# Altium schematic sheet 01_SERIALIZER_V1-0.SchDoc: RPi GS CAM SER.
size A3; Date: 2023-05-29; Author: M. Weimann; Organization: Altium Limited; Revision: 1.0; SheetNumber: 2; SheetTotal: 5; Title_Subtitle: Serializer; Language: DE; Department: F&E; Filename: RPi-GS-CAM-SER_PCB_V1-0.PDF; Project: PI-0017; DocType: Stromlauf; ItemNo-PCB: n/a
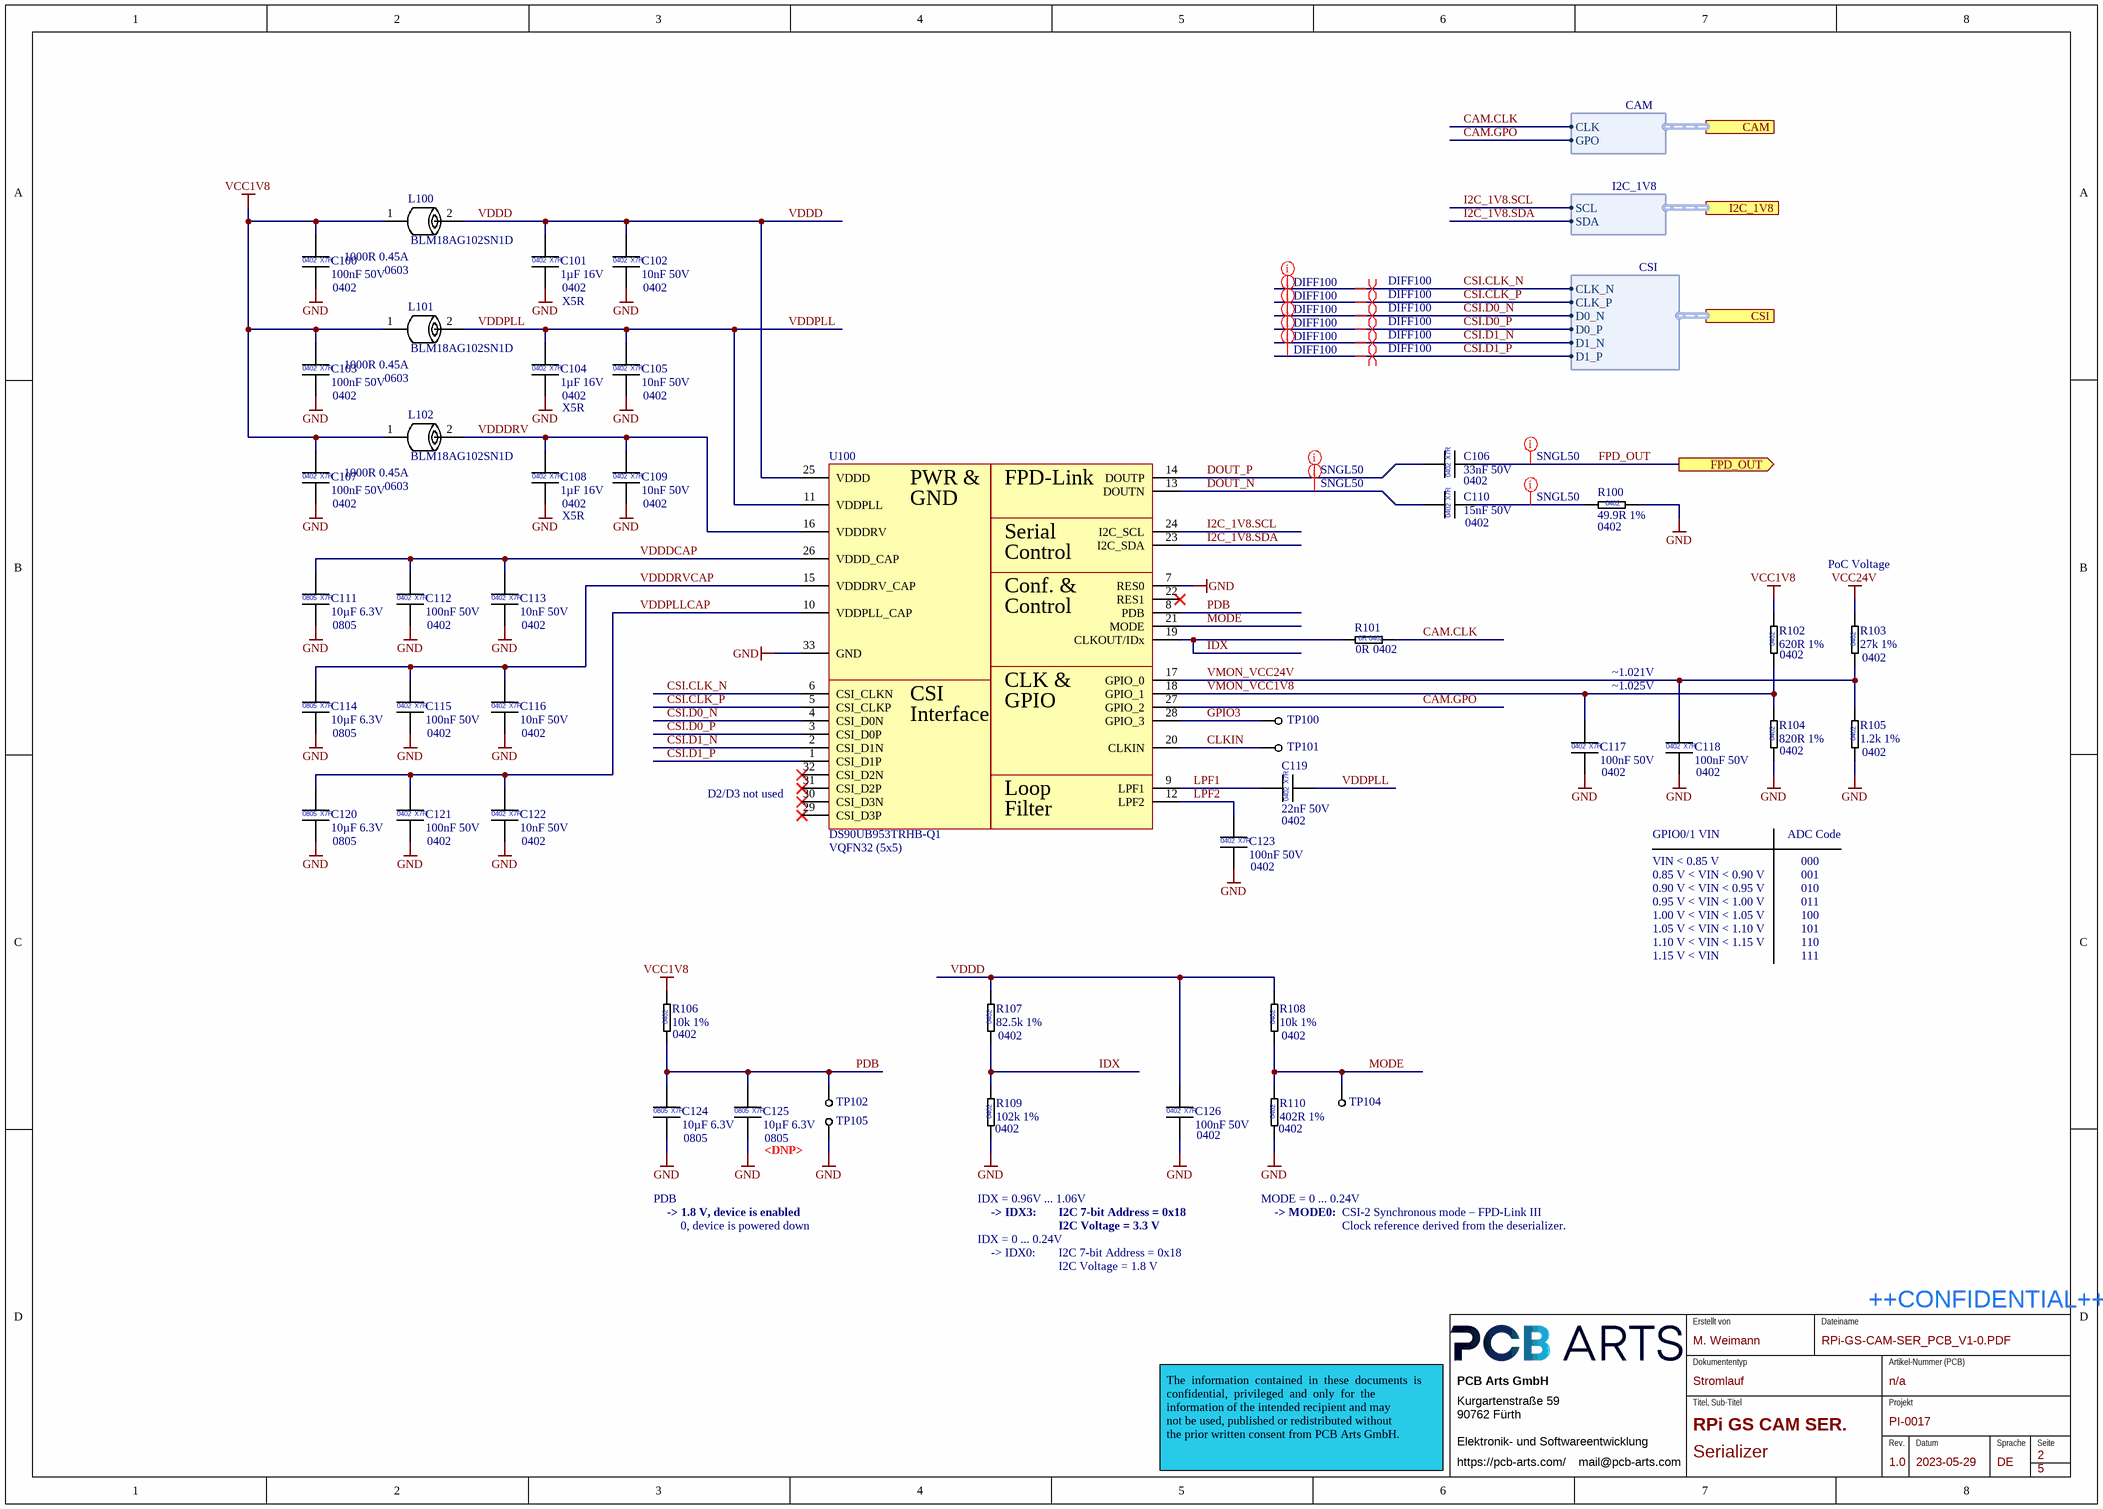
[diagram p0: 01_SERIALIZER_V1-0.SchDoc]

## Parts
C100  100nF 50V  [CAP_0402_L]
C101  1µF 16V  [CAP_0402_L]
C102  10nF 50V  [CAP_0402_L]
C103  100nF 50V  [CAP_0402_L]
C104  1µF 16V  [CAP_0402_L]
C105  10nF 50V  [CAP_0402_L]
C106  33nF 50V  [CAP_0402_L]
C107  100nF 50V  [CAP_0402_L]
C108  1µF 16V  [CAP_0402_L]
C109  10nF 50V  [CAP_0402_L]
C110  15nF 50V  [CAP_0402_L]
C111  10µF 6.3V  [CAP_0805]
C112  100nF 50V  [CAP_0402_L]
C113  10nF 50V  [CAP_0402_L]
C114  10µF 6.3V  [CAP_0805]
C115  100nF 50V  [CAP_0402_L]
C116  10nF 50V  [CAP_0402_L]
C117  100nF 50V  [CAP_0402_L]
C118  100nF 50V  [CAP_0402_L]
C119  22nF 50V  [CAP_0402_L]
C120  10µF 6.3V  [CAP_0805]
C121  100nF 50V  [CAP_0402_L]
C122  10nF 50V  [CAP_0402_L]
C123  100nF 50V  [CAP_0402_L]
C124  10µF 6.3V  [CAP_0805]
C125  10µF 6.3V  [CAP_0805]  (no BOM)
C126  100nF 50V  [CAP_0402_L]
L100  BLM18AG102SN1D  [L_0603]
L101  BLM18AG102SN1D  [L_0603]
L102  BLM18AG102SN1D  [L_0603]
R100  49.9R 1%  [RES_0402_L]
R101  0R Jumper  [RES_0402_L]  (value not drawn)
R102  620R 1%  [RES_0402_L]
R103  27k 1%  [RES_0402_L]
R104  820R 1%  [RES_0402_L]
R105  1.2k 1%  [RES_0402_L]
R106  10k 1%  [RES_0402_L]
R107  82.5k 1%  [RES_0402_L]
R108  10k 1%  [RES_0402_L]
R109  102k 1%  [RES_0402_L]
R110  402R 1%  [RES_0402_L]
TP100  Testpoint  [Testpoint 0.8mm]  (value not drawn)  (no BOM)
TP101  Testpoint  [Testpoint 0.8mm]  (value not drawn)  (no BOM)
TP102  Testpoint  [Testpoint 0.8mm]  (value not drawn)  (no BOM)
TP104  Testpoint  [Testpoint 0.8mm]  (value not drawn)  (no BOM)
TP105  Testpoint  [Testpoint 0.8mm]  (value not drawn)  (no BOM)
U100  DS90UB953TRHB-Q1  [VQFN50P500X500X100-33N]

## Ports
CAM (harness CAM, see 00_RPi-GS-CAM-SER_V1-0[4B], 03_CONNECTORS_V1-0[1B]), CSI (harness CSI, see 00_RPi-GS-CAM-SER_V1-0[4B], 03_CONNECTORS_V1-0[1B]), FPD_OUT (out, see 00_RPi-GS-CAM-SER_V1-0[4B], 03_CONNECTORS_V1-0[4A]), I2C_1V8 (harness I2C_1V8, see 00_RPi-GS-CAM-SER_V1-0[4B], 02_I2C_V1-0[1A])

## Harnesses
CSI: CLK_N, CLK_P, D0_N, D0_P, D1_P, D1_N
I2C_1V8: SCL, SDA
CAM: CLK, GPO

## Nets
GND: C100.2 C101.2 C102.2 C103.2 C104.2 C105.2 C107.2 C108.2 C109.2 C111.2 C112.2 C113.2 C114.2 C115.2 C116.2 C117.2 C118.2 C120.2 C121.2 C122.2 C123.2 C124.2 C125.2 C126.2 R100.2 R104.1 R105.1 R109.1 R110.1 TP105.1(GND) U100.7(RES0) U100.33(GND)
VCC1V8: C100.1 C103.1 C107.1 L100.1 L101.1 L102.1 R102.2 R106.2
VCC24V: R103.2
CAM.CLK: R101.2 ; port CAM.CLK
CAM.GPO: U100.27(GPIO_2) ; port CAM.GPO
CLKIN: TP101.1(GND) U100.20(CLKIN)
CSI.CLK_N: U100.6(CSI_CLKN) ; port CSI.CLK_N
CSI.CLK_P: U100.5(CSI_CLKP) ; port CSI.CLK_P
CSI.D0_N: U100.4(CSI_D0N) ; port CSI.D0_N
CSI.D0_P: U100.3(CSI_D0P) ; port CSI.D0_P
CSI.D1_N: U100.2(CSI_D1N) ; port CSI.D1_N
CSI.D1_P: U100.1(CSI_D1P) ; port CSI.D1_P
DOUT_N: C110.1 U100.13(DOUTN)
DOUT_P: C106.1 U100.14(DOUTP)
FPD_OUT: C106.2 ; port FPD_OUT
GPIO3: TP100.1(GND) U100.28(GPIO_3)
I2C_1V8.SCL: U100.24(I2C_SCL) ; port I2C_1V8.SCL
I2C_1V8.SDA: U100.23(I2C_SDA) ; port I2C_1V8.SDA
IDX: R101.1 R107.1 R109.2 U100.19(CLKOUT/IDx)
LPF1: C119.1 U100.9(LPF1)
LPF2: C123.1 U100.12(LPF2)
MODE: R108.1 R110.2 TP104.1(GND) U100.21(MODE)
PDB: C124.1 C125.1 R106.1 TP102.1(GND) U100.8(PDB)
VDDD: C101.1 C102.1 C126.1 L100.2 R107.2 R108.2 U100.25(VDDD)
VDDDCAP: C111.1 C112.1 C113.1 U100.26(VDDD_CAP)
VDDDRV: C108.1 C109.1 L102.2 U100.16(VDDDRV)
VDDDRVCAP: C114.1 C115.1 C116.1 U100.15(VDDDRV_CAP)
VDDPLL: C104.1 C105.1 C119.2 L101.2 U100.11(VDDPLL)
VDDPLLCAP: C120.1 C121.1 C122.1 U100.10(VDDPLL_CAP)
VMON_VCC1V8: C117.1 R102.1 R104.2 U100.18(GPIO_1)
VMON_VCC24V: C118.1 R103.1 R105.2 U100.17(GPIO_0)
NetC110_2: C110.2 R100.1

Not connected (* = marked no-connect by the designer): U100 22(RES1)* 29(CSI_D3P)* 30(CSI_D3N)* 31(CSI_D2P)* 32(CSI_D2N)*

## Layout directives
net class SNGL50: DOUT_N, DOUT_P, FPD_OUT, NetC110_2
differential pair; differential pair class DIFF100: CSI.CLK_N, CSI.CLK_P, CSI.D0_N, CSI.D0_P, CSI.D1_N, CSI.D1_P
net class DIFF100: CSI.CLK_N, CSI.CLK_P, CSI.D0_N, CSI.D0_P, CSI.D1_N, CSI.D1_P

## Notes on the sheet
- (near L100) 1000R 0.45A
- (near C100) 0402
- 0603
- (near C101) X5R
- (near C101) 0402
- (near C102) 0402
- (near L101) 1000R 0.45A
- (near C103) 0402
- (near C104) X5R
- (near C104) 0402
- (near C105) 0402
- (near C107) 0402
- (near L102) 1000R 0.45A
- (near L102) 0603
- (near C108) X5R
- (near C108) 0402
- (near C109) 0402
- 0402
- (near C110) 0402
- (near R100) 0402
- PoC Voltage
- (near C111) 0805
- (near C112) 0402
- (near C113) 0402
- (near R101) 0R
- (near R101) 0402
- ~1.021V
- ~1.025V
- (near R102) 0402
- (near R103) 0402
- (near C114) 0805
- (near C115) 0402
- (near C116) 0402
- (near C117) 0402
- (near C118) 0402
- (near R104) 0402
- (near R105) 0402
- (near C120) 0805
- (near C121) 0402
- (near C122) 0402
- (near U100) D2/D3 not used
- (near U100) VQFN32 (5x5)
- (near C119) 0402
- GPIO0/1 VIN
- ADC Code
- (near C123) 0402
- VIN < 0.85 V
- 0.85 V < VIN < 0.90 V
- 0.90 V < VIN < 0.95 V
- 0.95 V < VIN < 1.00 V
- 1.00 V < VIN < 1.05 V
- 000
- 001
- 010
- 011
- 100
- 1.05 V < VIN < 1.10 V
- 1.10 V < VIN < 1.15 V
- 1.15 V < VIN
- 101
- 110
- 111
- (near R106) 0402
- (near R107) 0402
- (near R108) 0402
- (near C124) 0805
- (near C125) 0805
- <DNP>
- (near R109) 0402
- (near C126) 0402
- (near R110) 0402
- PDB
- -> 1.8 V, device is enabled
- 0, device is powered down
- IDX = 0 ... 0.24V
- IDX = 0.96V ... 1.06V
- -> IDX0:
- -> IDX3:
- I2C 7-bit Address = 0x18
- I2C Voltage = 3.3 V
- MODE = 0 ... 0.24V
- -> MODE0:
- CSI-2 Synchronous mode – FPD-Link III
- Clock reference derived from the deserializer.
- I2C Voltage = 1.8 V
- Erstellt von
- Dateiname
- ++CONFIDENTIAL++
- PCB Arts GmbH
- Dokumententyp
- Artikel-Nummer (PCB)
- Kurgartenstraße 59
- 90762 Fürth
- Elektronik- und Softwareentwicklung
- Titel, Sub-Titel
- Projekt
- Rev.
- Datum
- Sprache
- Seite
- The  information  contained  in  these  documents  is  confidential,  privileged  and  only  for  the
  information of the intended recipient and may
  not be used, published or redistributed without
  the prior written consent from PCB Arts GmbH.
- https://pcb-arts.com/
- mail@pcb-arts.com
- (in symbol CAP_0402_1µF_16V) 0402; X7R
- (in symbol CAP_0402_10nF_50V) 0402; X7R
- (in symbol CAP_0402_15nF_50V) X7R; 0402
- (in symbol CAP_0402_22nF_50V) X7R; 0402
- (in symbol CAP_0402_33nF_50V) X7R; 0402
- (in symbol CAP_0402_100nF_50V) 0402; X7R
- (in symbol CAP_0805_10µF_6.3V_X7R_10%) 0805; X7R
- (in symbol DS90UB953TRHBTQ1_Serialiser CSI-2 Interface) PWR &; FPD-Link; Serial; Control; Conf. &; CLK &; CSI; GPIO; Interface; Loop; Filter
- (in symbol RES_0402_0R Jumper) 0R 0402
- (in symbol RES_0402_1.2k_1%) 0402
- (in symbol RES_0402_10k_1%) 0402
- (in symbol RES_0402_27k_1%) 0402
- (in symbol RES_0402_49.9R_1%) 0402
- (in symbol RES_0402_82.5k_1%) 0402
- (in symbol RES_0402_102k_1%) 0402
- (in symbol RES_0402_402R_1%) 0402
- (in symbol RES_0402_620R_1%) 0402
- (in symbol RES_0402_820R_1%) 0402

## Library data of the parts
C100 C103 C107 C112 C115 C117 C118 C121 C123 C126 = CAP_0402_100nF_50V: Multilayer Ceramic Capacitors MLCC - SMD/SMT 0402 50VDC; Manufacturer 1: Murata Electronics; Manufacturer 1 Prt. Nr.: GCM155L8EH104KE07D; Manufacturer 2 Prt. Nr.: UMK105B7104KV-FR; Manufacturer 2: TDK
C101 C104 C108 = CAP_0402_1µF_16V: Multilayer Ceramic Capacitors MLCC - SMD/SMT 0402 16VDC; Manufacturer 1: Taiyo Yuden; Manufacturer 1 Prt. Nr.: EMK105BJ105MVHF; Manufacturer 2 Prt. Nr.: GRM155R61E105KA12D; Manufacturer 2: Murata Electronics
C102 C105 C109 C113 C116 C122 = CAP_0402_10nF_50V: Multilayer Ceramic Capacitors MLCC - SMD/SMT 0402 50VDC; Manufacturer 1: Wurth Elektronik; Manufacturer 1 Prt. Nr.: 885012205067; Manufacturer 2 Prt. Nr.: AC0402KPX7R9BB103; Manufacturer 2: Yageo
C106 = CAP_0402_33nF_50V: Multilayer Ceramic Capacitors MLCC - SMD/SMT 0402 50VDC; Manufacturer 1: Murata; Manufacturer 1 Prt. Nr.: GRT155R71H333KE01D; Manufacturer 2 Prt. Nr.: CC0402KRX7R9BB333; Manufacturer 2: Yageo
C110 = CAP_0402_15nF_50V: Multilayer Ceramic Capacitors MLCC - SMD/SMT 0402 50VDC; Manufacturer 1: Murata; Manufacturer 1 Prt. Nr.: GRM155R71H153KA12J; Manufacturer 2 Prt. Nr.: CC0402KRX7R9BB153; Manufacturer 2: Yageo
C111 C114 C120 C124 C125 = CAP_0805_10µF_6.3V_X7R_10%: Multilayer Ceramic Capacitors MLCC - SMD/SMT 10 uF 6.3 VDC 10% 0805 X7R; Manufacturer 1: Murata Electronics; Manufacturer 1 Prt. Nr.: GRM21BR70J106KA73L; Manufacturer 2 Prt. Nr.: CGA4J1X7R0J106K125AC; Manufacturer 2: TDK
C119 = CAP_0402_22nF_50V: Multilayer Ceramic Capacitors MLCC - SMD/SMT 0402 50VDC; Manufacturer 1: Murata; Manufacturer 1 Prt. Nr.: GRT155R71H223KE01D; Manufacturer 2 Prt. Nr.: 0402B223K500CT; Manufacturer 2: Walsin
L100-L102 = BLM18AG102SN1D_Ferrite Beads 0603 1000Ohms 450mA: Ferrite Beads BLM18 1000Ohms 450mA 0,5Ohm; Manufacturer 1: Murata Electronics; Manufacturer 1 Prt. Nr.: BLM18AG102SN1D
R100 = RES_0402_49.9R_1%: Thick Film Resistors - SMD 49.9Ohm 1%; Manufacturer 1: Vishay / Dale; Manufacturer 1 Prt. Nr.: CRCW040249R9FKEDC; Manufacturer 2 Prt. Nr.: RC0402FR-7W49R9L; Manufacturer 2: Yageo
R101 = RES_0402_0R Jumper: Thick Film Resistors - SMD 0Ohm; Manufacturer 1: Vishay / Dale; Manufacturer 1 Prt. Nr.: CRCW04020000Z0EDC; Manufacturer 2 Prt. Nr.: RC0402JR-070RL; Manufacturer 2: Yageo
R102 = RES_0402_620R_1%: Thick Film Resistors - SMD 1/16watt 620ohms 1%; Manufacturer 1: Vishay / Dale; Manufacturer 1 Prt. Nr.: CRCW0402620RFKED; Manufacturer 2 Prt. Nr.: RC0402FR-07620RL; Manufacturer 2: Yageo
R103 = RES_0402_27k_1%: Thick Film Resistors - SMD 27kOhm 1%; Manufacturer 1: Vishay / Dale; Manufacturer 1 Prt. Nr.: CRCW040227K0FKEDC; Manufacturer 2 Prt. Nr.: RT0402FRE0727KL; Manufacturer 2: Yageo
R104 = RES_0402_820R_1%: Thick Film Resistors - SMD 1/16watt 820ohms 1%; Manufacturer 1: Vishay / Dale; Manufacturer 1 Prt. Nr.: CRCW0402820RFKED; Manufacturer 2 Prt. Nr.: RC0402FR-07820RL; Manufacturer 2: Yageo
R105 = RES_0402_1.2k_1%: Thick Film Resistors - SMD 1/16watt 1.2Kohms 1%; Manufacturer 1: Vishay / Dale; Manufacturer 1 Prt. Nr.: CRCW04021K20FKEDC; Manufacturer 2 Prt. Nr.: RC0402FR-7W1K2L; Manufacturer 2: Yageo
R106 R108 = RES_0402_10k_1%: Thick Film Resistors - SMD 10kOhm 1%; Manufacturer 1: Vishay / Dale; Manufacturer 1 Prt. Nr.: CRCW040210K0FKEDC; Manufacturer 2 Prt. Nr.: RC0402FR-7W10KL; Manufacturer 2: Yageo
R107 = RES_0402_82.5k_1%: Thick Film Resistors - SMD 1/16W 82.5Kohms 1%; Manufacturer 1: Vishay / Dale; Manufacturer 1 Prt. Nr.: CRCW040282k5FKEDC; Manufacturer 2 Prt. Nr.: CR0402-FX-8252GLF; Manufacturer 2: Bourns
R109 = RES_0402_102k_1%: Thick Film Resistors - SMD 102KOHM 1/16WATT 1%; Manufacturer 1: Vishay / Dale; Manufacturer 1 Prt. Nr.: CRCW0402102kFKEDC; Manufacturer 2 Prt. Nr.: CR0402-FX-1023GLF; Manufacturer 2: Bourns
R110 = RES_0402_402R_1%: Thick Film Resistors - SMD 402Ohms 1/16W 0402 1%; Manufacturer 1: Vishay / Dale; Manufacturer 1 Prt. Nr.: CRCW0402402RFKEDC; Manufacturer 2 Prt. Nr.: RC0402FR-7W402RL; Manufacturer 2: Yageo
TP100-TP102 TP104 TP105 = Testpoint 0.8mm
U100 = DS90UB953TRHBTQ1_Serialiser CSI-2 Interface: Serialisierer & Deserialisierer - Serdes 2 MP MIPI CSI-2 FPD-Link III serializer for 2MP/60fps cameras & radar 32-VQFN -40 to 105; Manufacturer 1: Texas Instruments; Manufacturer 1 Prt. Nr.: DS90UB953TRHBTQ1